# EAGLE schematic example-sch (EAGLE 9.7.0)
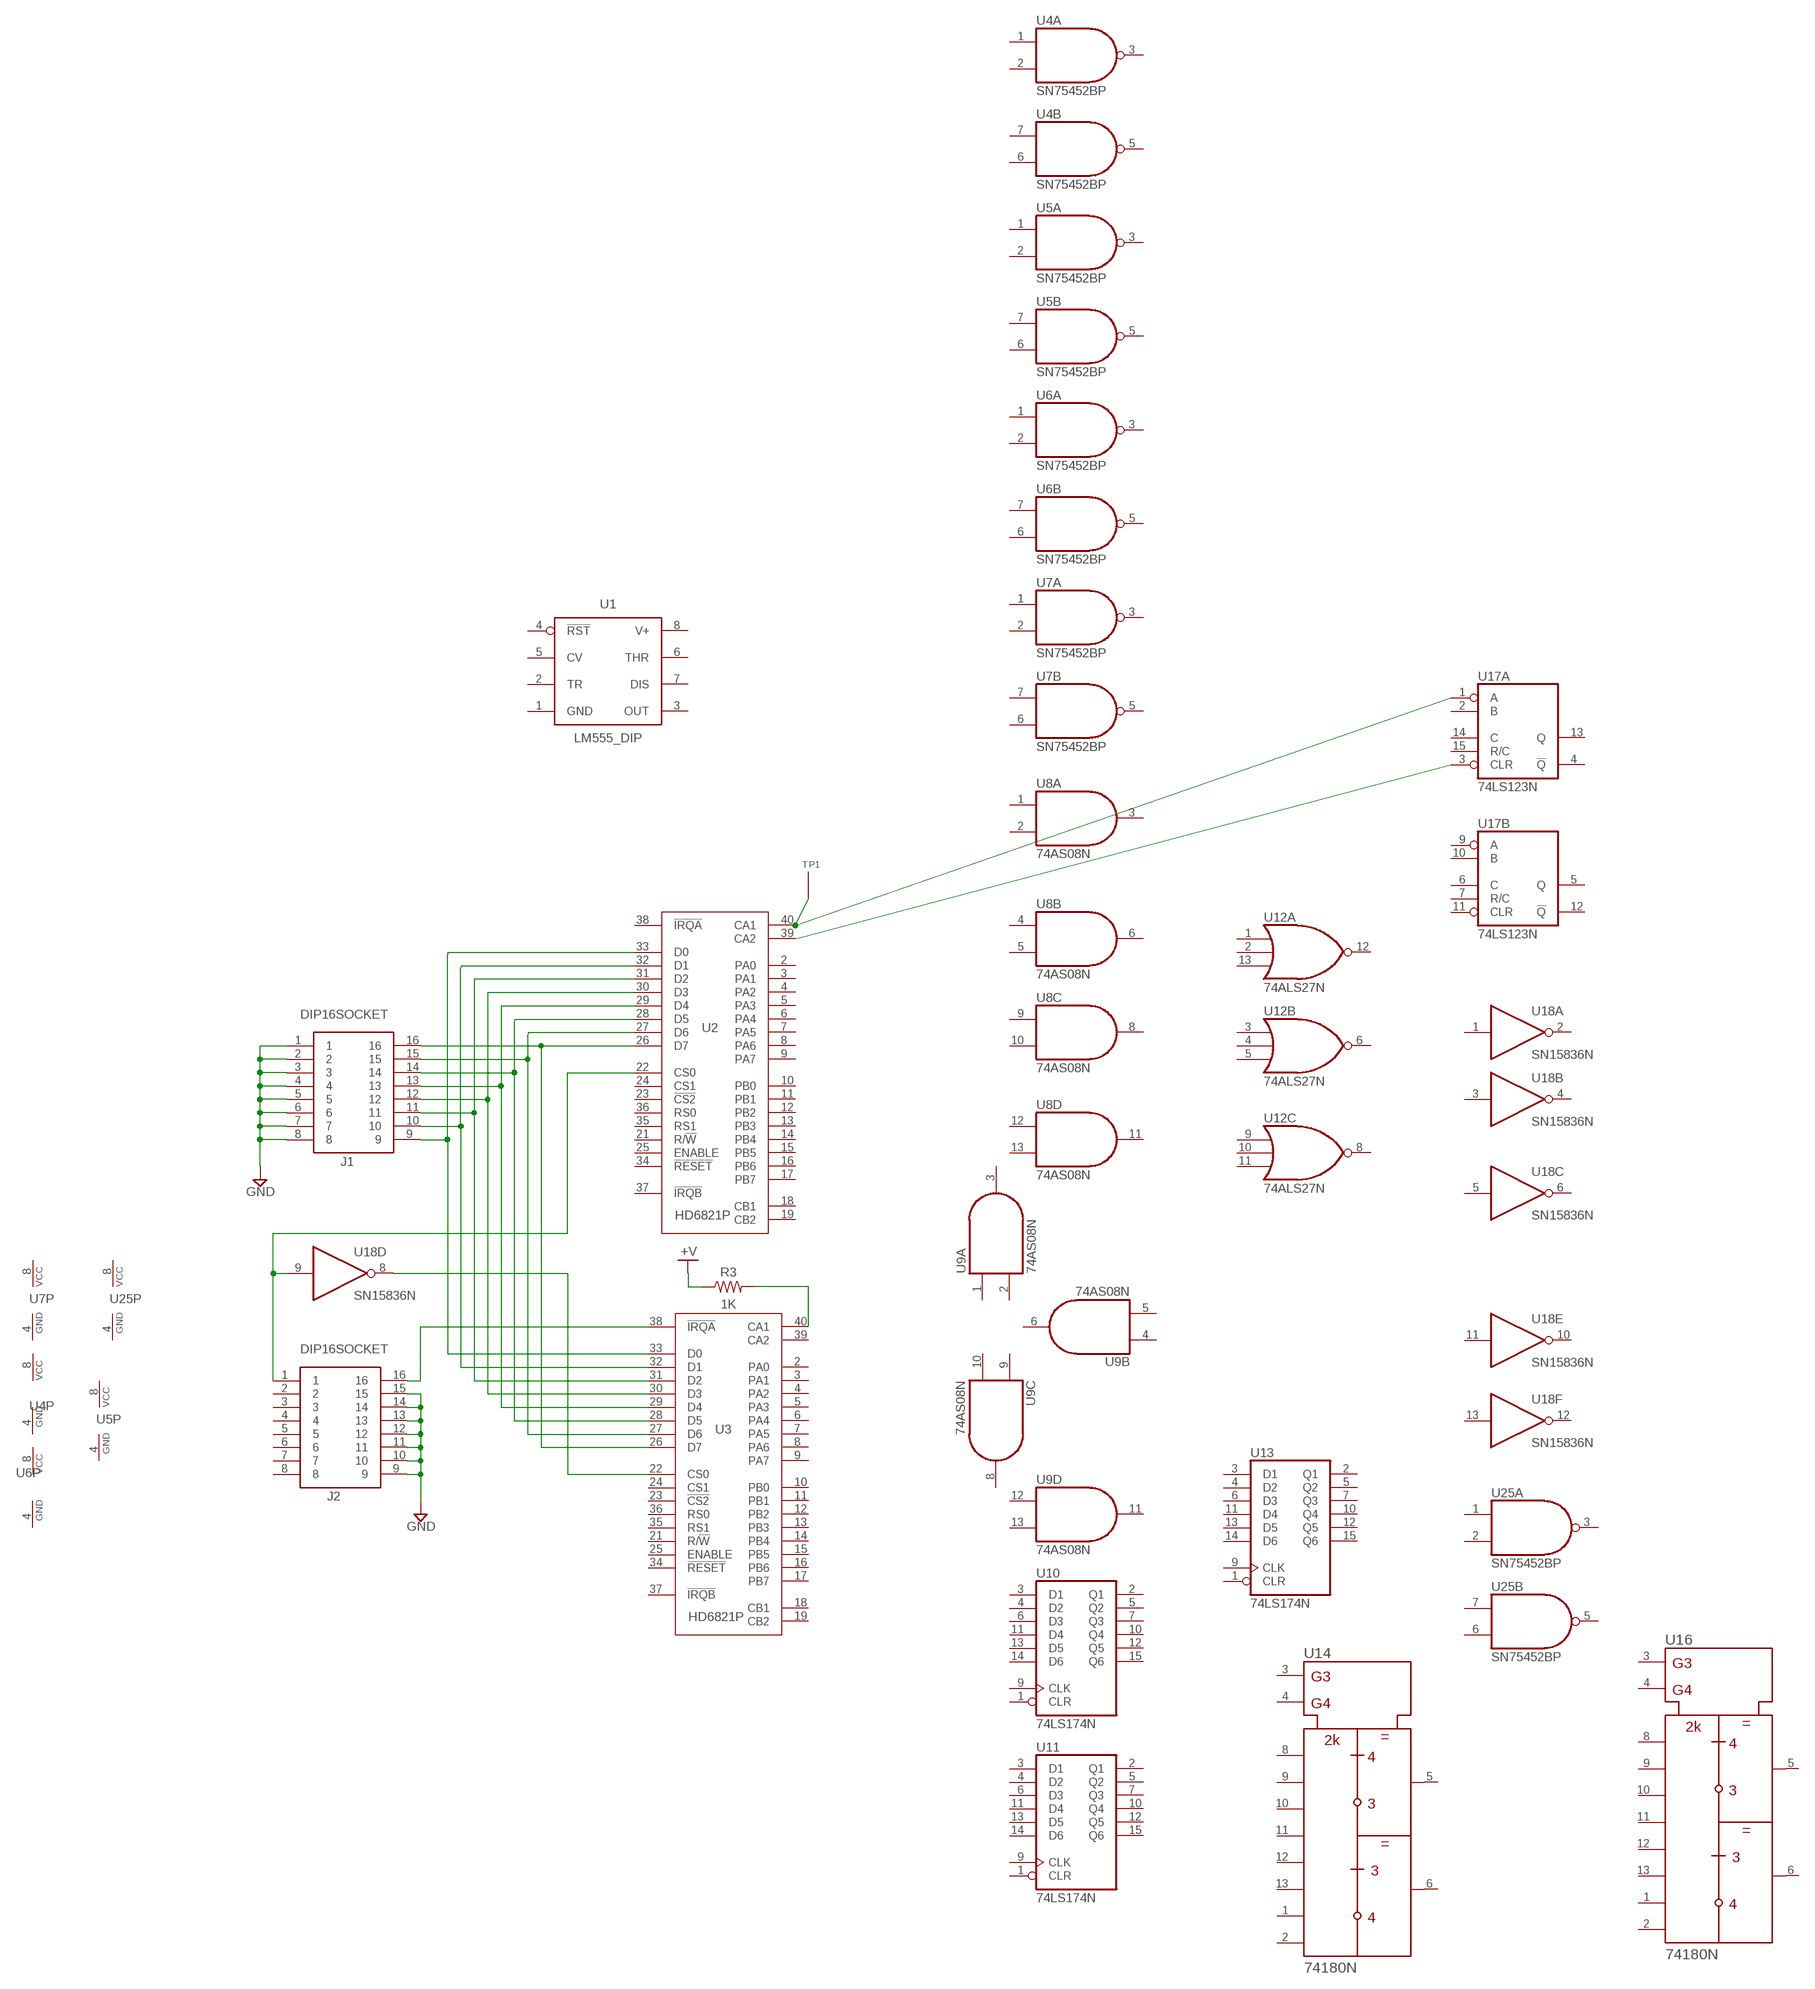
[diagram p0: schematic, sheet 1]

## Parts
J1  DIP16SOCKET  [DIL16]
J2  DIP16SOCKET  [DIL16]
R3  1K  R-US_AXIAL-11.7MM-PITCH  [RESAD1176W63L850D250B]
TP1  TESTPOINT  [TESTPOINT]
U1  LM555_DIP  [DIP826W53P254L959H508Q8B]
U2  HD6821P  [DIL40]
U3  HD6821P  [DIL40]
U4  SN75452BP  [DIL08]
U5  SN75452BP  [DIL08]
U6  SN75452BP  [DIL08]
U7  SN75452BP  [DIL08]
U8  74AS08N  [DIL14]
U9  74AS08N  [DIL14]
U10  74LS174N  [DIL16]
U11  74LS174N  [DIL16]
U12  74ALS27N  [DIL14]
U13  74LS174N  [DIL16]
U14  74180N  [DIL14]
U16  74180N  [DIL14]
U17  74LS123N  [DIL16]
U18  SN15836N  [DIL14]
U25  SN75452BP  [DIL08]

## Nets
+V: R3.1
GND: J1.1 J1.2 J1.3 J1.4 J1.5 J1.6 J1.7 J1.8 J2.9 J2.10 J2.11 J2.12 J2.13 J2.14 J2.15
N$1: J1.9 U2.33(D0) U3.33(D0)
N$2: J1.10 U2.32(D1) U3.32(D1)
N$3: J1.11 U2.31(D2) U3.31(D2)
N$4: J1.12 U2.30(D3) U3.30(D3)
N$5: J1.13 U2.29(D4) U3.29(D4)
N$6: J1.14 U2.28(D5) U3.28(D5)
N$7: J1.15 U2.27(D6) U3.27(D6)
N$8: J1.16 U2.26(D7) U3.26(D7)
N$9: J2.16 U3.38(!IRQA)
N$10: U3.22(CS0) U18.8(D:O)
N$11: TP1.P$1(TP) U2.40(CA1) U17.1(A:A)
N$12: R3.2 U3.40(CA1)
N$13: U2.39(CA2) U17.3(A:CLR)
U17: J2.1 U2.22(CS0) U18.9(D:I)
Unconnected: J2.2 J2.3 J2.4 J2.5 J2.6 J2.7 J2.8 U1.2(TR) U1.3(OUT) U1.4(!RST) U1.5(CV) U1.6(THR) U1.7(DIS) U2.2(PA0) U2.3(PA1) U2.4(PA2) U2.5(PA3) U2.6(PA4) U2.7(PA5) U2.8(PA6) U2.9(PA7) U2.10(PB0) U2.11(PB1) U2.12(PB2) U2.13(PB3) U2.14(PB4) U2.15(PB5) U2.16(PB6) U2.17(PB7) U2.18(CB1) U2.19(CB2) U2.21(R/!W) U2.23(!CS2) U2.24(CS1) U2.25(ENABLE) U2.34(!RESET) U2.35(RS1) U2.36(RS0) U2.37(!IRQB) U2.38(!IRQA) U3.2(PA0) U3.3(PA1) U3.4(PA2) U3.5(PA3) U3.6(PA4) U3.7(PA5) U3.8(PA6) U3.9(PA7) U3.10(PB0) U3.11(PB1) U3.12(PB2) U3.13(PB3) U3.14(PB4) U3.15(PB5) U3.16(PB6) U3.17(PB7) U3.18(CB1) U3.19(CB2) U3.21(R/!W) U3.23(!CS2) U3.24(CS1) U3.25(ENABLE) U3.34(!RESET) U3.35(RS1) U3.36(RS0) U3.37(!IRQB) U3.39(CA2) U4.1(A:I0) U4.2(A:I1) U4.3(A:O) U4.5(B:O) U4.6(B:I1) U4.7(B:I0) U5.1(A:I0) U5.2(A:I1) U5.3(A:O) U5.5(B:O) U5.6(B:I1) U5.7(B:I0) U6.1(A:I0) U6.2(A:I1) U6.3(A:O) U6.5(B:O) U6.6(B:I1) U6.7(B:I0) U7.1(A:I0) U7.2(A:I1) U7.3(A:O) U7.5(B:O) U7.6(B:I1) U7.7(B:I0) U8.1(A:I0) U8.2(A:I1) U8.3(A:O) U8.4(B:I0) U8.5(B:I1) U8.6(B:O) U8.8(C:O) U8.9(C:I0) U8.10(C:I1) U8.11(D:O) U8.12(D:I0) U8.13(D:I1) U9.1(A:I0) U9.2(A:I1) U9.3(A:O) U9.4(B:I0) U9.5(B:I1) U9.6(B:O) U9.8(C:O) U9.9(C:I0) U9.10(C:I1) U9.11(D:O) U9.12(D:I0) U9.13(D:I1) U10.1(CLR) U10.2(Q1) U10.3(D1) U10.4(D2) U10.5(Q2) U10.6(D3) U10.7(Q3) U10.9(CLK) U10.10(Q4) U10.11(D4) U10.12(Q5) U10.13(D5) U10.14(D6) U10.15(Q6) U11.1(CLR) U11.2(Q1) U11.3(D1) U11.4(D2) U11.5(Q2) U11.6(D3) U11.7(Q3) U11.9(CLK) U11.10(Q4) U11.11(D4) U11.12(Q5) U11.13(D5) U11.14(D6) U11.15(Q6) U12.1(A:I0) U12.2(A:I1) U12.3(B:I0) U12.4(B:I1) U12.5(B:I2) U12.6(B:O) U12.8(C:O) U12.9(C:I0) U12.10(C:I1) U12.11(C:I2) U12.12(A:O) U12.13(A:I2) U13.1(CLR) U13.2(Q1) U13.3(D1) U13.4(D2) U13.5(Q2) U13.6(D3) U13.7(Q3) U13.9(CLK) U13.10(Q4) U13.11(D4) U13.12(Q5) U13.13(D5) U13.14(D6) U13.15(Q6) U14.1(G) U14.2(H) U14.3(EVEN) U14.4(ODD) U14.5(SEVEN) U14.6(SODD) U14.8(A) U14.9(B) U14.10(C) U14.11(D) U14.12(E) U14.13(F) U16.1(G) U16.2(H) U16.3(EVEN) U16.4(ODD) U16.5(SEVEN) U16.6(SODD) U16.8(A) U16.9(B) U16.10(C) U16.11(D) U16.12(E) U16.13(F) U17.2(A:B) U17.4(A:!Q) U17.5(B:Q) U17.6(B:C) U17.7(B:R/C) U17.9(B:A) U17.10(B:B) U17.11(B:CLR) U17.12(B:!Q) U17.13(A:Q) U17.14(A:C) U17.15(A:R/C) U18.1(A:I) U18.2(A:O) U18.3(B:I) U18.4(B:O) U18.5(C:I) U18.6(C:O) U18.10(E:O) U18.11(E:I) U18.12(F:O) U18.13(F:I) U25.1(A:I0) U25.2(A:I1) U25.3(A:O) U25.5(B:O) U25.6(B:I1) U25.7(B:I0)

## Power pins joined to a net without a drawn wire
+UB: U14.14(+UB) U16.14(+UB)
-UB: U14.7(-UB) U16.7(-UB)
GND: U1.1(GND) U4.4(P:GND) U5.4(P:GND) U6.4(P:GND) U7.4(P:GND) U8.7(P:GND) U9.7(P:GND) U10.8(GND) U11.8(GND) U12.7(P:GND) U13.8(GND) U17.8(P:GND) U18.7(GND) U25.4(P:GND)
V+: U1.8(V+)
VCC: U4.8(P:VCC) U5.8(P:VCC) U6.8(P:VCC) U7.8(P:VCC) U8.14(P:VCC) U9.14(P:VCC) U10.16(VCC) U11.16(VCC) U12.14(P:VCC) U13.16(VCC) U17.16(P:VCC) U18.14(VCC) U25.8(P:VCC)

## Library data of the parts
J1 J2 = owen-library:DIP16SOCKET
R3 = Resistor:R-US: Resistor Fixed - ANSI; CATEGORY: Resistor; SUB-CATEGORY: Fixed
TP1 = owen-library:TESTPOINT
U1 = IC_Clock-Timing:*555: TIMER 555 General purpose precision timers NE555 : Texas Datasheet <http://www.ti.com/general/docs/suppproductinfo.tsp?distId=10&gotoUrl=http%3A%2F%2Fwww.ti.com%2Flit%2Fgpn%2Fne555>, Diodes Incorporated Datasheet <https://www.diodes.com/assets/Datasheets/NE555_SA555_NA555.pdf> LM555 Datasheet <http://www.ti.com/general/docs/suppproductinfo.tsp?distId=10&gotoUrl=http%3A%2F%2Fwww.ti.com%2Flit%2Fgpn%2Flm555> LMC555 Datasheet <http://www.ti.com/general/docs/suppproductinfo.tsp?distId=10&gotoUrl=http%3A%2F%2Fwww.ti.com%2Flit%2Fgpn%2Flmc555> ICM7555 : Maxim Integrated Datasheet <https://datasheets.maximintegrated.com/en/ds/ICM7555-ICM7556.pdf>, Renesas Electronics America Inc Datasheet <https://www.renesas.com/en-us/www/doc/datasheet/icm7555-56.pdf>; CATEGORY: IC_Clock-Timing; CURRENT-SUPPLY: 10mA; DESCRIPTION: IC OSC SINGLE TIMER 100KHZ 8-DIP; FREQUENCY: 100kHz; MANUFACTURER: Texas Instruments; MPN: LM555CN/NOPB; OPERATING_TEMP: 0°C to 70°C; PART_STATUS: Active; ROHS_COMPLIANT: ROHS3 Compliant; SUB-CATEGORY: Timer
U2 U3 = owen-library:HD6821P
U4-U7 U25 = texas-sn55-sn75:SN75452B: NAND PERIPHERAL DRIVERS FOR HIGH-CURRENT SWITCHING AT VERY HIGH SPEEDS Source: www.ti.com sn75452b.pdf
U8 U9 = 74xx-us:74*08: Quad 2-input AND gate
U10 U11 U13 = 74xx-us:74*174: Hex D type FLIP FLOP, clear
U12 = 74xx-us:74*27: Triple 3-input NOR gate
U14 U16 = 74ttl-din:74*180: 9-bit odd/even PARITY GENERATOR/CHECKER
U17 = 74xx-us:74*123: Retriggerable monostable MULTIVIBRATOR
U18 = owen-library:SN15836: Hex INVERTER; CATEGORY: IC_Logic; SUB-CATEGORY: Inverter